# EAGLE design TSOP_jr3 (EAGLE 7.6.0)
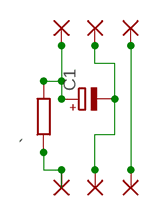
[diagram p0: schematic, sheet 1]

## Parts
"  1,6/0,9  [1,6/0,9]
""  1,6/0,9  [1,6/0,9]
"""  1,6/0,9  [1,6/0,9]
....  1,6/0,9  [1,6/0,9]
.....  1,6/0,9  [1,6/0,9]
......  1,6/0,9  [1,6/0,9]
`  R-EU_0204/5  [0204/5]
C1  CPOL-EUE1.8-4  [E1,8-4]

## Nets
N$1: ".1(P) .......1(P)
N$2: "".1(P) ......1(P) C1.-
N$3: """.1(P) `.2 C1.+
N$4: .....1(P) `.1

## Library data of the parts
" "" """ .... ..... ...... = wirepad:1,6/0,9: THROUGH-HOLE PAD
` = resistor:R-EU_: RESISTOR, European symbol
C1 = rcl:CPOL-EU: POLARIZED CAPACITOR, European symbol

## Board
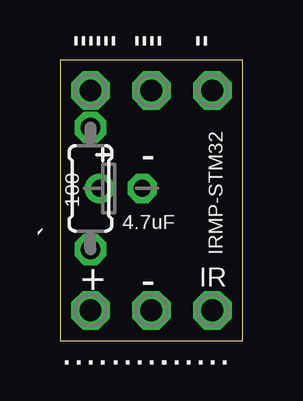
[diagram p1: board, top side]
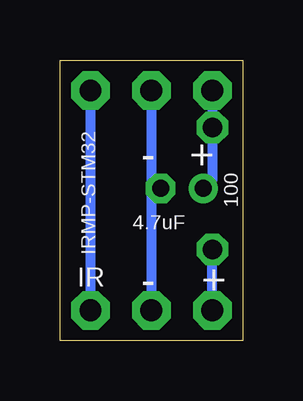
[diagram p2: board, bottom side, seen from below]

Size 7.62 x 11.7 mm. Coordinates in mm from the lower left corner, seen from the top.
Outline: 0,0 7.62,0 7.62,11.7 0,11.7 0,0
Copper layers (1*16): Top 0.035mm / dielectric 1.5mm / Bottom 0.035mm
Design rules "default *": minimum track width 10mil, minimum drill 24mil, track to track 8mil, track to pad 8mil, pad to pad 8mil, via to via 8mil, smd to smd 8mil, copper to edge 0mil, drill to drill 8mil, minimum pad ring 10mil, minimum via ring 8mil, stop-mask expansion 4mil, vias tented up to drill 0mil, thermal gap 10mil

### Footprints (pad centres in the part's own frame; a part is rotated, then mirrored left to right if it is on the bottom)
1,6/0,9 = drill 0.914 pad 1.6 octagon: 1 0,0
0204/5 = drill 0.813 octagon: 1 -2.54,0; 2 2.54,0
E1,8-4 = drill 0.711 pad 1.168: + -0.889,0 | drill 0.711 pad 1.168 octagon: - 0.889,0

### Placement (x,y rotation side)
"  6.35,10.43 0 top
""  3.81,10.43 0 top
"""  1.27,10.43 0 top
....  1.27,1.27 180 top
.....  3.81,1.27 180 top
......  6.35,1.27 180 top
`  1.27,6.35 90 top
C1  2.54,6.35 0 top

### Tracks (layer width: path | path; a pad name or v marks a point on that pad's centre or on a via)
N$1
  Bottom 0.406: ".1 .......1
N$2
  Bottom 0.406: "".1 3.81,6.35 | 3.81,6.35 ......1 | C1.- 3.81,6.35
N$3
  Bottom 0.406: """.1 `.2 1.27,6.73 C1.+
N$4
  Bottom 0.406: .....1 `.1

### Text on the board
tNames: - | 100 | 4.7uF | IRMP-STM32 | IR | + | -
bNames: + | - | 100 | 4.7uF | IRMP-STM32 | IR | + | -